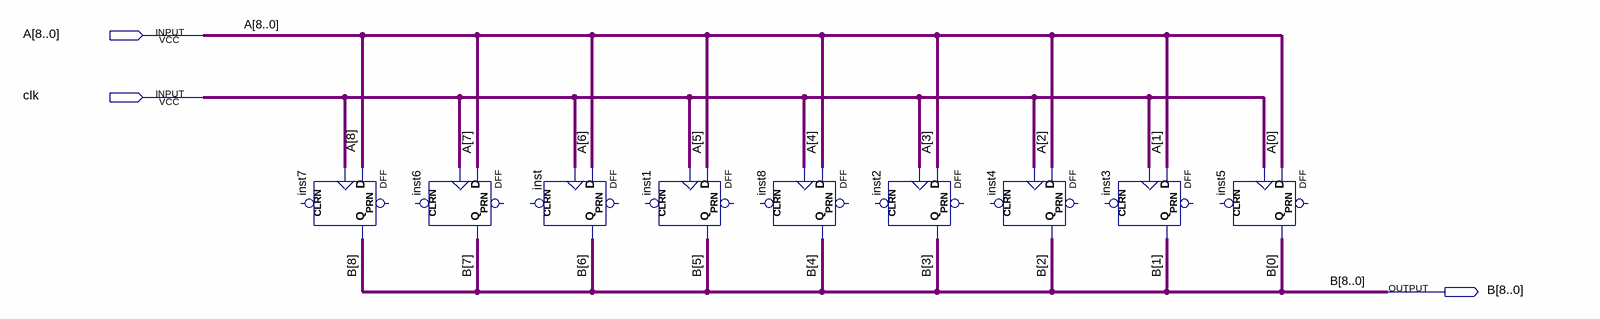
[diagram p0: schematic sheet]
// Quartus schematic trigger9.bdf as structural Verilog: 9 symbols, 3 pins
module trigger9 (
  input  [8:0] A,
  input  clk,
  output [8:0] B
);

  DFF inst7 (.CLK(clk), .D(A[8]), .Q(B[8]));  // open: CLRN, PRN
  DFF inst6 (.CLK(clk), .D(A[7]), .Q(B[7]));  // open: CLRN, PRN
  DFF inst (.CLK(clk), .D(A[6]), .Q(B[6]));  // open: CLRN, PRN
  DFF inst1 (.CLK(clk), .D(A[5]), .Q(B[5]));  // open: CLRN, PRN
  DFF inst8 (.CLK(clk), .D(A[4]), .Q(B[4]));  // open: CLRN, PRN
  DFF inst2 (.CLK(clk), .D(A[3]), .Q(B[3]));  // open: CLRN, PRN
  DFF inst4 (.CLK(clk), .D(A[2]), .Q(B[2]));  // open: CLRN, PRN
  DFF inst3 (.CLK(clk), .D(A[1]), .Q(B[1]));  // open: CLRN, PRN
  DFF inst5 (.CLK(clk), .D(A[0]), .Q(B[0]));  // open: CLRN, PRN
endmodule
